# Altium schematic sheet transboard.SchDoc
size A4; SheetNumber: 1; SheetTotal: 1
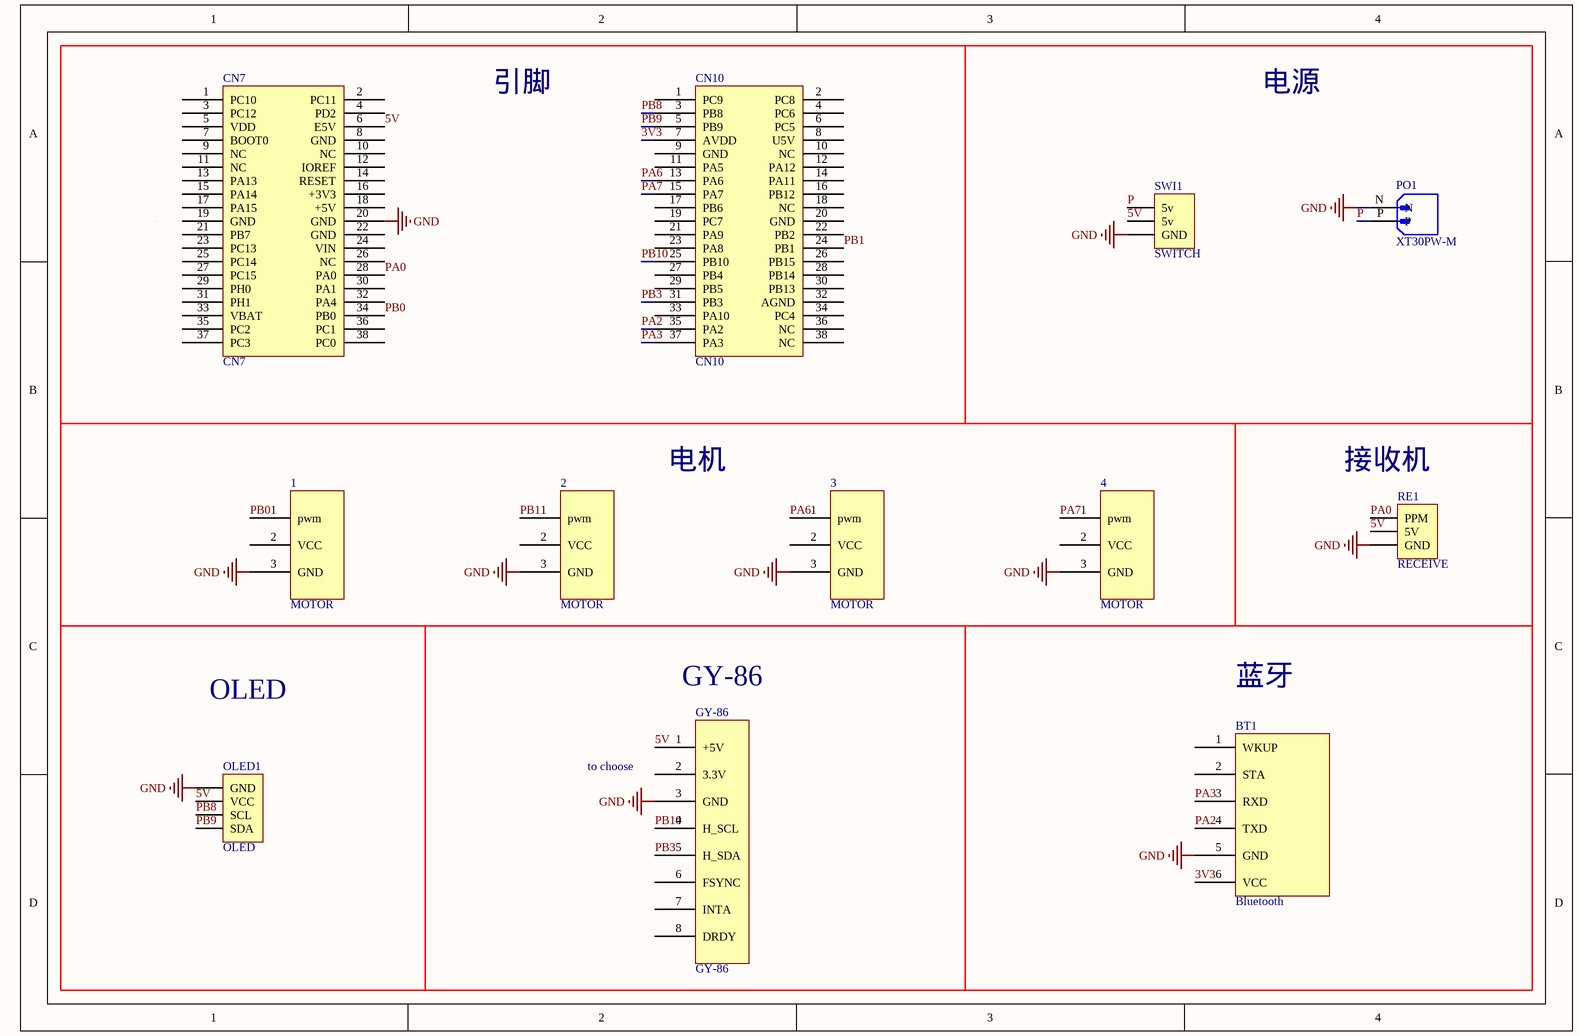
[diagram p0: transboard.SchDoc]

## Parts
1  MOTOR  [M]
2  MOTOR  [M]
3  MOTOR  [M]
4  MOTOR  [M]
BT1  Bluetooth  [Bluetooth]
CN7  CN7  [CN7]
CN10  CN10  [CN10]
GY-86  GY-86  [HDR1X8]
OLED1  OLED  [HDR1X4]
PO1  XT30PW-M  [AMASS_XT30PW-M]
RE1  RECEIVE  [HDR1X3]
SWI1  SWITCH  [HDR1X3]

## Nets
GND: 1.3(GND) 2.3(GND) 3.3(GND) 4.3(GND) BT1.5(GND) CN7.20(GND) GY-86.3(GND) OLED1.1(GND) PO1.N RE1.3(GND) SWI1.3(GND)
3V3: BT1.6(VCC) CN10.7(AVDD)
5V: CN7.6(E5V) GY-86.1(+5V) OLED1.2(VCC) RE1.2(5V) SWI1.2(5v)
P: PO1.P SWI1.1(5v)
PA0: CN7.28(PA0) RE1.1(PPM)
PA2: BT1.4(TXD) CN10.35(PA2)
PA3: BT1.3(RXD) CN10.37(PA3)
PA6: 3.1(pwm) CN10.13(PA6)
PA7: 4.1(pwm) CN10.15(PA7)
PB0: 1.1(pwm) CN7.34(PB0)
PB1: 2.1(pwm) CN10.24(PB1)
PB3: CN10.31(PB3) GY-86.5(H_SDA)
PB8: CN10.3(PB8) OLED1.3(SCL)
PB9: CN10.5(PB9) OLED1.4(SDA)
PB10: CN10.25(PB10) GY-86.4(H_SCL)

Not connected (* = marked no-connect by the designer): 1 2(VCC); 2 2(VCC); 3 2(VCC); 4 2(VCC); BT1 1(WKUP) 2(STA); CN7 1(PC10) 2(PC11) 3(PC12) 4(PD2) 5(VDD) 7(BOOT0) 8(GND) 9(NC) 10(NC) 11(NC) 12(IOREF) 13(PA13) 14(RESET) 15(PA14) 16(+3V3) 17(PA15) 18(+5V) 19(GND) 21(PB7) 22(GND) 23(PC13) 24(VIN) 25(PC14) 26(NC) 27(PC15) 29(PH0) 30(PA1) 31(PH1) 32(PA4) 33(VBAT) 35(PC2) 36(PC1) 37(PC3) 38(PC0); CN10 1(PC9) 2(PC8) 4(PC6) 6(PC5) 8(U5V) 9(GND) 10(NC) 11(PA5) 12(PA12) 14(PA11) 16(PB12) 17(PB6) 18(NC) 19(PC7) 20(GND) 21(PA9) 22(PB2) 23(PA8) 26(PB15) 27(PB4) 28(PB14) 29(PB5) 30(PB13) 32(AGND) 33(PA10) 34(PC4) 36(NC) 38(NC); GY-86 2(3.3V) 6(FSYNC) 7(INTA) 8(DRDY)

## Notes on the sheet
- 引脚
- 电源
- 电机
- (near RE1) 接收机
- OLED
- GY-86
- 蓝牙
- (near GY-86) to choose

## Library data of the parts
1-4 = M
OLED1 = Header 4: Header, 4-Pin; LatestRevisionDate: 17-Jul-2002; LatestRevisionNote: Re-released for DXP Platform.; Publisher: Altium Limited
PO1 = XT30PW-M: Socket; DC supply; XT30; male; PIN: 2; on PCBs; THT; Colour: yellow; MF: AMASS; Package: None; Price: None; Value: *; SnapEDA_Link: https://www.snapeda.com/parts/XT30PW-M/AMASS/view-part/?ref=snap; MP: XT30PW-M; Availability: Not in stock; Check_prices: https://www.snapeda.com/parts/XT30PW-M/AMASS/view-part/?ref=eda
RE1 = Header 3: Header, 3-Pin; LatestRevisionDate: 17-Jul-2002; LatestRevisionNote: Re-released for DXP Platform.; Publisher: Altium Limited
SWI1 = Header 3_1: Header, 3-Pin; LatestRevisionDate: 17-Jul-2002; LatestRevisionNote: Re-released for DXP Platform.; Publisher: Altium Limited